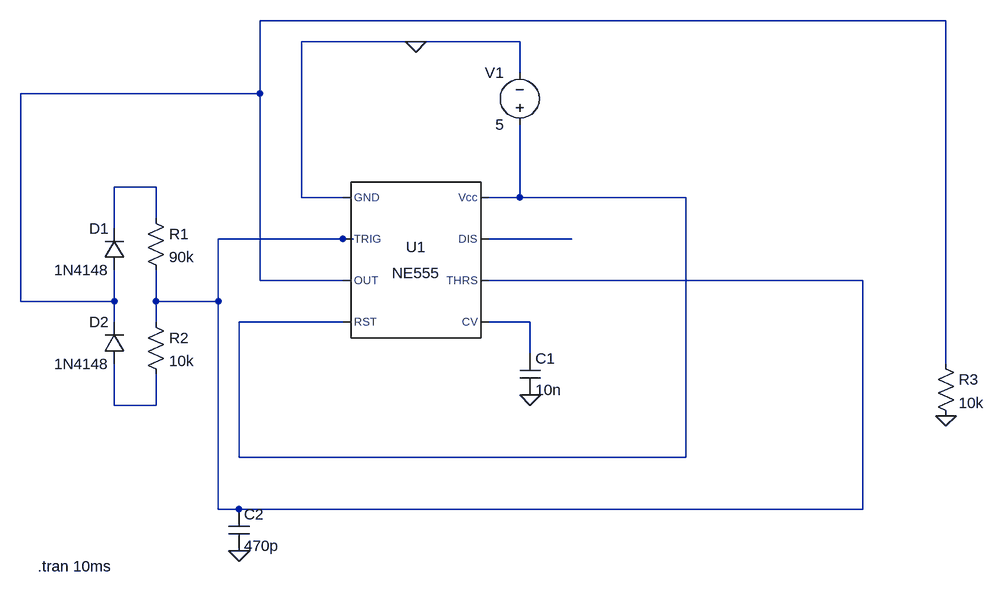
[diagram p0: schematic PWM.asc]
PWM.asc, the LTspice schematic file:
Version 4
SHEET 1 1140 680
WIRE 1072 -176 16 -176
WIRE 256 -144 80 -144
WIRE 416 -144 256 -144
WIRE 416 -96 416 -144
WIRE 16 -64 16 -176
WIRE 16 -64 -352 -64
WIRE -144 80 -208 80
WIRE 80 96 80 -144
WIRE 144 96 80 96
WIRE 416 96 416 -16
WIRE 416 96 368 96
WIRE 672 96 416 96
WIRE -144 128 -144 80
WIRE -208 144 -208 80
WIRE 144 160 -48 160
WIRE 160 160 144 160
WIRE 496 160 368 160
WIRE 16 224 16 -64
WIRE 144 224 16 224
WIRE 944 224 368 224
WIRE -352 256 -352 -64
WIRE -208 256 -208 208
WIRE -208 256 -352 256
WIRE -144 256 -144 208
WIRE -48 256 -48 160
WIRE -48 256 -144 256
WIRE -208 288 -208 256
WIRE -144 288 -144 256
WIRE 144 288 -16 288
WIRE 432 288 368 288
WIRE 432 336 432 288
WIRE 1072 352 1072 -176
WIRE -208 416 -208 352
WIRE -144 416 -144 368
WIRE -144 416 -208 416
WIRE -16 496 -16 288
WIRE 672 496 672 96
WIRE 672 496 -16 496
WIRE -48 576 -48 256
WIRE -16 576 -48 576
WIRE 944 576 944 224
WIRE 944 576 -16 576
FLAG 432 400 0
FLAG 256 -144 0
FLAG -16 640 0
FLAG 1072 432 0
SYMBOL Misc\\NE555 256 192 R0
SYMATTR InstName U1
SYMBOL voltage 416 0 R180
WINDOW 0 24 96 Left 2
WINDOW 3 24 16 Left 2
WINDOW 123 0 0 Left 2
WINDOW 39 0 0 Left 2
SYMATTR InstName V1
SYMATTR Value 5
SYMBOL cap 416 336 R0
SYMATTR InstName C1
SYMATTR Value 10n
SYMBOL res -160 112 R0
SYMATTR InstName R1
SYMATTR Value 90k
SYMBOL res -160 272 R0
SYMATTR InstName R2
SYMATTR Value 10k
SYMBOL diode -192 208 R180
WINDOW 0 24 64 Left 2
WINDOW 3 24 0 Left 2
SYMATTR InstName D1
SYMATTR Value 1N4148
SYMBOL diode -192 352 R180
WINDOW 0 24 64 Left 2
WINDOW 3 24 0 Left 2
SYMATTR InstName D2
SYMATTR Value 1N4148
SYMBOL cap -32 576 R0
SYMATTR InstName C2
SYMATTR Value 470p
SYMBOL res 1056 336 R0
SYMATTR InstName R3
SYMATTR Value 10k
TEXT -326 664 Left 2 !.tran 10ms

The netlist it stands for:
* PWM.asc
XU1 0 N004 N001 N003 N006 N004 N005 N003 NE555  ; pins GND TRIG OUT RST CV THRS DIS Vcc
V1 N003 0 5
C1 N006 0 10n
R1 N002 N004 90k
R2 N004 N007 10k
D1 N001 N002 1N4148
D2 N007 N001 1N4148
C2 N004 0 470p
R3 N001 0 10k
.model D D
.lib standard.dio
.tran 10ms
.lib NE555.sub
.backanno
.end